# EAGLE design ds32 (EAGLE 6.6.0)

## Sheet 1 of 3
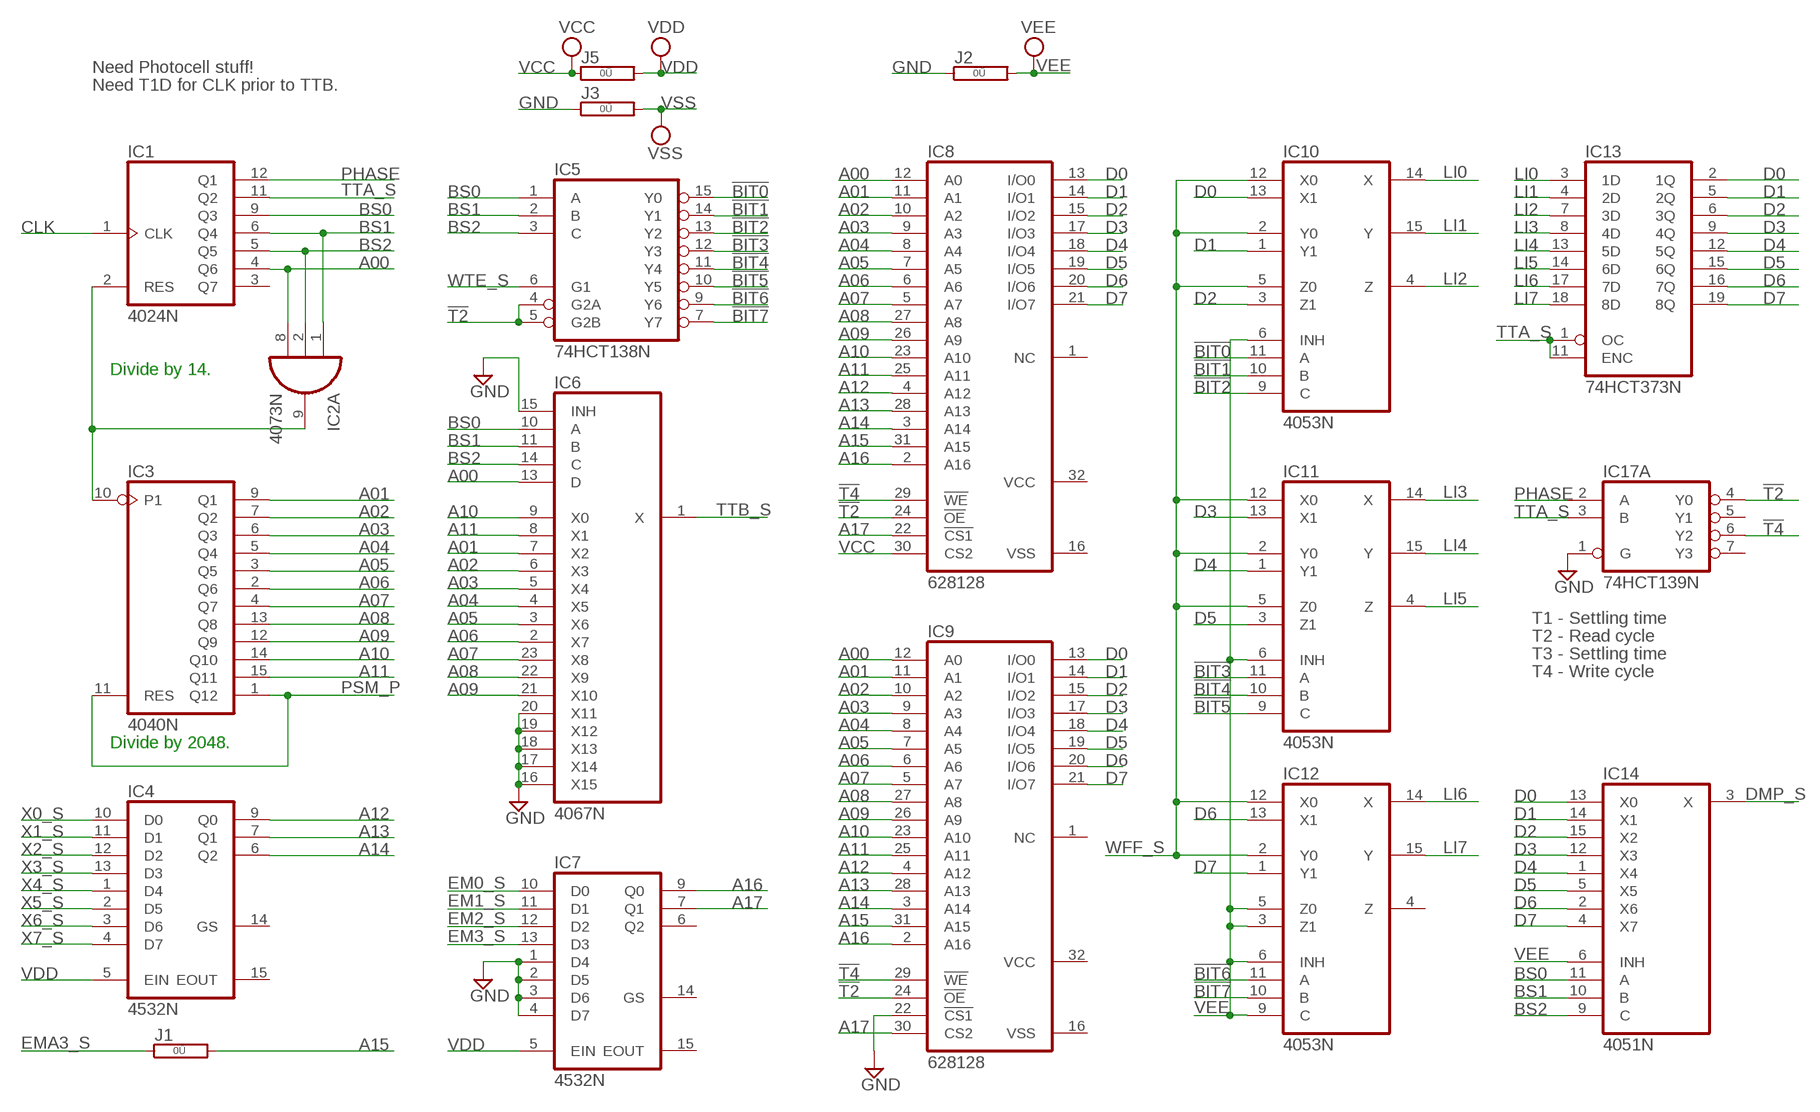
[diagram p0: schematic, sheet 1]

### Parts
IC1  4024N  [DIL14]
IC2  4073N  [DIL14]
IC3  4040N  [DIL16]
IC4  4532N  [DIL16]
IC5  74HCT138N  74LS138N  [DIL16]
IC6  4067N  [DIL24-6]
IC7  4532N  [DIL16]
IC8  628128  628128P  [DIL32]
IC9  628128  628128P  [DIL32]
IC10  4053N  [DIL16]
IC11  4053N  [DIL16]
IC12  4053N  [DIL16]
IC13  74HCT373N  74LS373N  [DIL20]
IC14  4051N  [DIL16]
IC17  74HCT139N  74LS139N  [DIL16]
J1  0R  [0R/10]
J2  0R  [0R/10]
J3  0R  [0R/10]
J5  0R  [0R/10]

### Nets
!BIT0: IC5.15(Y0) IC10.11(A)
!BIT1: IC5.14(Y1) IC10.10(B)
!BIT2: IC5.13(Y2) IC10.9(C)
!BIT3: IC5.12(Y3) IC11.11(A)
!BIT4: IC5.11(Y4) IC11.10(B)
!BIT5: IC5.10(Y5) IC11.9(C)
!BIT6: IC5.9(Y6) IC12.11(A)
!BIT7: IC5.7(Y7) IC12.10(B)
!T2: IC5.4(G2A) IC5.5(G2B) IC8.24(!OE) IC9.24(!OE) IC17.4(A:Y0)
!T4: IC8.29(!WE) IC9.29(!WE) IC17.6(A:Y2)
A00: IC1.4(Q6) IC2.8(A:I2) IC6.13(D) IC8.12(A0) IC9.12(A0)
A01: IC3.9(Q1) IC6.7(X2) IC8.11(A1) IC9.11(A1)
A02: IC3.7(Q2) IC6.6(X3) IC8.10(A2) IC9.10(A2)
A03: IC3.6(Q3) IC6.5(X4) IC8.9(A3) IC9.9(A3)
A04: IC3.5(Q4) IC6.4(X5) IC8.8(A4) IC9.8(A4)
A05: IC3.3(Q5) IC6.3(X6) IC8.7(A5) IC9.7(A5)
A06: IC3.2(Q6) IC6.2(X7) IC8.6(A6) IC9.6(A6)
A07: IC3.4(Q7) IC6.23(X8) IC8.5(A7) IC9.5(A7)
A08: IC3.13(Q8) IC6.22(X9) IC8.27(A8) IC9.27(A8)
A09: IC3.12(Q9) IC6.21(X10) IC8.26(A9) IC9.26(A9)
A10: IC3.14(Q10) IC6.9(X0) IC8.23(A10) IC9.23(A10)
A11: IC3.15(Q11) IC6.8(X1) IC8.25(A11) IC9.25(A11)
A12: IC4.9(Q0) IC8.4(A12) IC9.4(A12)
A13: IC4.7(Q1) IC8.28(A13) IC9.28(A13)
A14: IC4.6(Q2) IC8.3(A14) IC9.3(A14)
A15: IC8.31(A15) IC9.31(A15) J1.2
A16: IC7.9(Q0) IC8.2(A16) IC9.2(A16)
A17: IC7.7(Q1) IC8.22(!CS1) IC9.30(CS2)
BS0: IC1.9(Q3) IC5.1(A) IC6.10(A) IC14.11(A)
BS1: IC1.6(Q4) IC2.1(A:I0) IC5.2(B) IC6.11(B) IC14.10(B)
BS2: IC1.5(Q5) IC2.2(A:I1) IC5.3(C) IC6.14(C) IC14.9(C)
CLK: IC1.1(CLK) ; also sheet 3
D0: IC8.13(I/O0) IC9.13(I/O0) IC10.13(X1) IC13.2(1Q) IC14.13(X0)
D1: IC8.14(I/O1) IC9.14(I/O1) IC10.1(Y1) IC13.5(2Q) IC14.14(X1)
D2: IC8.15(I/O2) IC9.15(I/O2) IC10.3(Z1) IC13.6(3Q) IC14.15(X2)
D3: IC8.17(I/O3) IC9.17(I/O3) IC11.13(X1) IC13.9(4Q) IC14.12(X3)
D4: IC8.18(I/O4) IC9.18(I/O4) IC11.1(Y1) IC13.12(5Q) IC14.1(X4)
D5: IC8.19(I/O5) IC9.19(I/O5) IC11.3(Z1) IC13.15(6Q) IC14.5(X5)
D6: IC8.20(I/O6) IC9.20(I/O6) IC12.13(X1) IC13.16(7Q) IC14.2(X6)
D7: IC8.21(I/O7) IC9.21(I/O7) IC12.1(Y1) IC13.19(8Q) IC14.4(X7)
DMP_S: IC14.3(X) ; also sheet 2
EM0_S: IC7.10(D0) ; also sheet 2
EM1_S: IC7.11(D1) ; also sheet 2
EM2_S: IC7.12(D2) ; also sheet 2
EM3_S: IC7.13(D3) ; also sheet 2
EMA3_S: J1.1 ; also sheet 2
GND [Supply]: IC6.15(INH) IC6.16(X15) IC6.17(X14) IC6.18(X13) IC6.19(X12) IC6.20(X11) IC7.1(D4) IC7.2(D5) IC7.3(D6) IC7.4(D7) IC9.22(!CS1) IC17.1(A:G) J2.1 J3.1 ; also sheet 2,3
LI0: IC10.14(X) IC13.3(1D)
LI1: IC10.15(Y) IC13.4(2D)
LI2: IC10.4(Z) IC13.7(3D)
LI3: IC11.14(X) IC13.8(4D)
LI4: IC11.15(Y) IC13.13(5D)
LI5: IC11.4(Z) IC13.14(6D)
LI6: IC12.14(X) IC13.17(7D)
LI7: IC12.15(Y) IC13.18(8D)
N$1: IC1.2(RES) IC2.9(A:O) IC3.10(P1)
PHASE: IC1.12(Q1) IC17.2(A:A)
PSM_P: IC3.1(Q12) IC3.11(RES) ; also sheet 3
TTA_S: IC1.11(Q2) IC13.1(OC) IC13.11(ENC) IC17.3(A:B) ; also sheet 2
TTB_S: IC6.1(X) ; also sheet 2
VCC [Supply]: IC8.30(CS2) J5.1 ; also sheet 2,3
VDD [Supply]: IC4.5(EIN) IC7.5(EIN) J5.2
VEE: IC10.6(INH) IC11.6(INH) IC12.3(Z1) IC12.5(Z0) IC12.6(INH) IC12.9(C) IC14.6(INH) J2.2
VSS [Supply]: J3.2
WFF_S: IC10.2(Y0) IC10.5(Z0) IC10.12(X0) IC11.2(Y0) IC11.5(Z0) IC11.12(X0) IC12.2(Y0) IC12.12(X0) ; also sheet 2
WTE_S: IC5.6(G1) ; also sheet 2
X0_S: IC4.10(D0) ; also sheet 2
X1_S: IC4.11(D1) ; also sheet 2
X2_S: IC4.12(D2) ; also sheet 2
X3_S: IC4.13(D3) ; also sheet 2
X4_S: IC4.1(D4) ; also sheet 2
X5_S: IC4.2(D5) ; also sheet 2
X6_S: IC4.3(D6) ; also sheet 2
X7_S: IC4.4(D7) ; also sheet 2
Unconnected: IC1.3(Q7) IC2.10(C:O) IC2.11(C:I0) IC2.12(C:I1) IC2.13(C:I2) IC4.14(GS) IC4.15(EOUT) IC7.6(Q2) IC7.14(GS) IC7.15(EOUT) IC8.1(NC) IC9.1(NC) IC12.4(Z) IC17.5(A:Y1) IC17.7(A:Y3) IC17.9(B:Y3) IC17.10(B:Y2) IC17.11(B:Y1) IC17.12(B:Y0) IC17.13(B:B) IC17.14(B:A) IC17.15(B:G)

### Notes on the sheet
- Need Photocell stuff!
- Need T1D for CLK prior to TTB.
- Divide by 14.
- T1 - Settling time
- T2 - Read cycle
- T3 - Settling time
- T4 - Write cycle
- Divide by 2048.

## Sheet 2 of 3
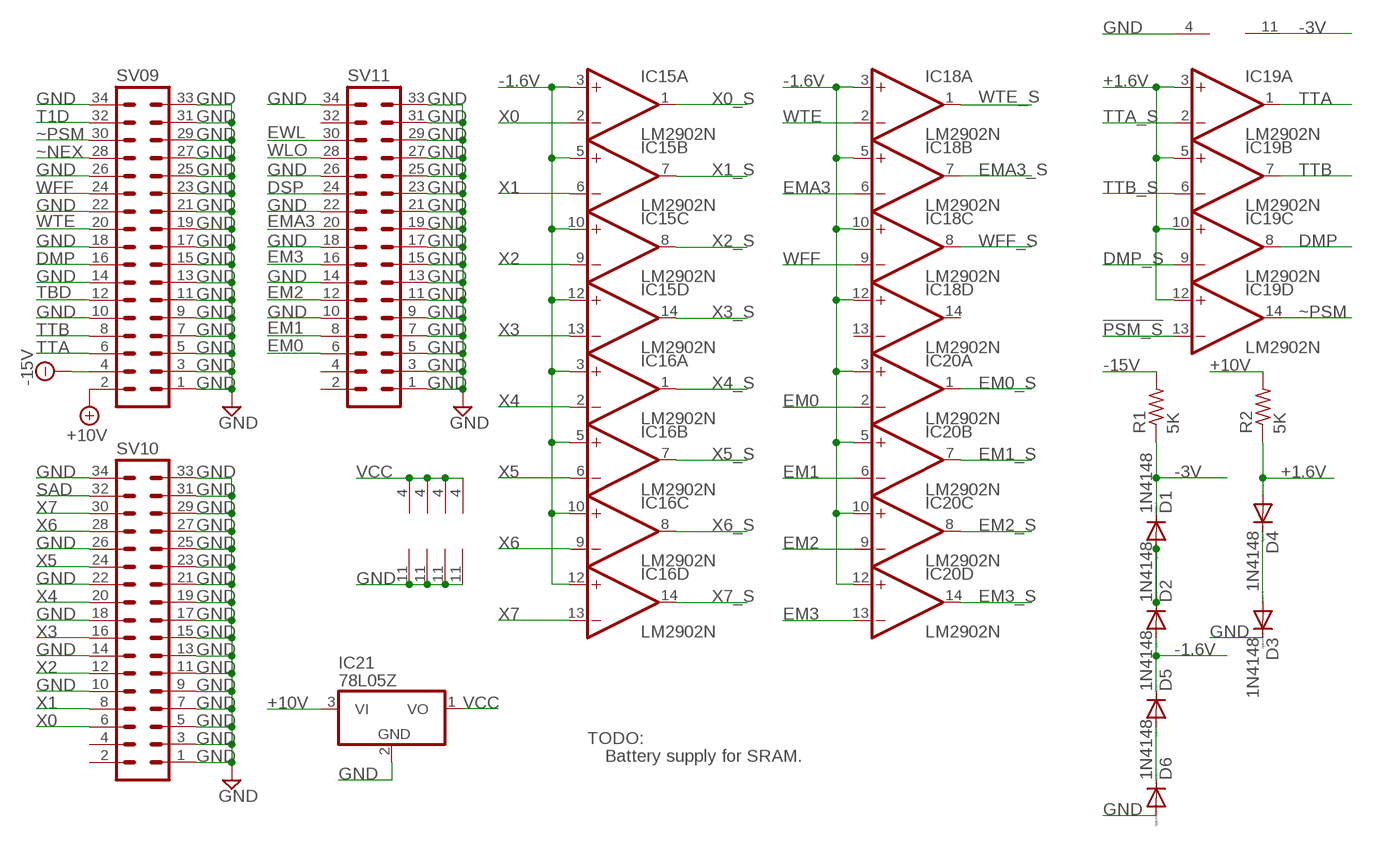
[diagram p1: schematic, sheet 2]

### Parts
D1  1N4148  1N4148DO35-10  [DO35-10]
D2  1N4148  1N4148DO35-10  [DO35-10]
D3  1N4148  1N4148DO35-10  [DO35-10]
D4  1N4148  1N4148DO35-10  [DO35-10]
D5  1N4148  1N4148DO35-10  [DO35-10]
D6  1N4148  1N4148DO35-10  [DO35-10]
IC15  LM2902N  [DIL14]
IC16  LM2902N  [DIL14]
IC18  LM2902N  [DIL14]
IC19  LM2902N  [DIL14]
IC20  LM2902N  [DIL14]
IC21  78L05Z  [TO92]
R1  5K  R-US_0207/10  [0207/10]
R2  5K  R-US_0207/10  [0207/10]
SV09  MA17-2  [MA17-2]
SV10  MA17-2  [MA17-2]
SV11  MA17-2  [MA17-2]

### Nets
!PSM_S: IC19.13(D:-IN) ; also sheet 3
+1.6V [Supply]: D4.A IC19.3(A:+IN) IC19.5(B:+IN) IC19.10(C:+IN) IC19.12(D:+IN) R2.1
+10V: IC21.3(VI) R2.2 SV09.2
-1.6V [Supply]: D2.A D5.C IC15.3(A:+IN) IC15.5(B:+IN) IC15.10(C:+IN) IC15.12(D:+IN) IC16.3(A:+IN) IC16.5(B:+IN) IC16.10(C:+IN) IC16.12(D:+IN) IC18.3(A:+IN) IC18.5(B:+IN) IC18.10(C:+IN) IC18.12(D:+IN) IC20.3(A:+IN) IC20.5(B:+IN) IC20.10(C:+IN) IC20.12(D:+IN)
-3V [Supply]: D1.C IC19.11(P:V-) R1.1 ; also sheet 3
-15V: R1.2 SV09.4
DMP: IC19.8(C:OUT) SV09.16
DMP_S: IC19.9(C:-IN) ; also sheet 1
DSP: SV11.24
EM0: IC20.2(A:-IN) SV11.6
EM0_S: IC20.1(A:OUT) ; also sheet 1
EM1: IC20.6(B:-IN) SV11.8
EM1_S: IC20.7(B:OUT) ; also sheet 1
EM2: IC20.9(C:-IN) SV11.12
EM2_S: IC20.8(C:OUT) ; also sheet 1
EM3: IC20.13(D:-IN) SV11.16
EM3_S: IC20.14(D:OUT) ; also sheet 1
EMA3: IC18.6(B:-IN) SV11.20
EMA3_S: IC18.7(B:OUT) ; also sheet 1
EWL: SV11.30
GND [Supply]: D3.C D6.A IC15.11(P:V-) IC16.11(P:V-) IC18.11(P:V-) IC19.4(P:V+) IC20.11(P:V-) IC21.2(GND) SV09.1 SV09.3 SV09.5 SV09.7 SV09.9 SV09.10 SV09.11 SV09.13 SV09.14 SV09.15 SV09.17 SV09.18 SV09.19 SV09.21 SV09.22 SV09.23 SV09.25 SV09.26 SV09.27 SV09.29 SV09.31 SV09.33 SV09.34 SV10.1 SV10.3 SV10.5 SV10.7 SV10.9 SV10.10 SV10.11 SV10.13 SV10.14 SV10.15 SV10.17 SV10.18 SV10.19 SV10.21 SV10.22 SV10.23 SV10.25 SV10.26 SV10.27 SV10.29 SV10.31 SV10.33 SV10.34 SV11.1 SV11.3 SV11.5 SV11.7 SV11.9 SV11.10 SV11.11 SV11.13 SV11.14 SV11.15 SV11.17 SV11.18 SV11.19 SV11.21 SV11.22 SV11.23 SV11.25 SV11.26 SV11.27 SV11.29 SV11.31 SV11.33 SV11.34 ; also sheet 1,3
N$2: D1.A D2.C
N$3: D3.A D4.C
N$5: D5.A D6.C
SAD: SV10.32
T1D: SV09.32
TBD: SV09.12
TTA: IC19.1(A:OUT) SV09.6
TTA_S: IC19.2(A:-IN) ; also sheet 1
TTB: IC19.7(B:OUT) SV09.8
TTB_S: IC19.6(B:-IN) ; also sheet 1
VCC [Supply]: IC15.4(P:V+) IC16.4(P:V+) IC18.4(P:V+) IC20.4(P:V+) IC21.1(VO) ; also sheet 1,3
WFF: IC18.9(C:-IN) SV09.24
WFF_S: IC18.8(C:OUT) ; also sheet 1
WLO: SV11.28 ; also sheet 3
WTE: IC18.2(A:-IN) SV09.20
WTE_S: IC18.1(A:OUT) ; also sheet 1
X0: IC15.2(A:-IN) SV10.6
X0_S: IC15.1(A:OUT) ; also sheet 1
X1: IC15.6(B:-IN) SV10.8
X1_S: IC15.7(B:OUT) ; also sheet 1
X2: IC15.9(C:-IN) SV10.12
X2_S: IC15.8(C:OUT) ; also sheet 1
X3: IC15.13(D:-IN) SV10.16
X3_S: IC15.14(D:OUT) ; also sheet 1
X4: IC16.2(A:-IN) SV10.20
X4_S: IC16.1(A:OUT) ; also sheet 1
X5: IC16.6(B:-IN) SV10.24
X5_S: IC16.7(B:OUT) ; also sheet 1
X6: IC16.9(C:-IN) SV10.28
X6_S: IC16.8(C:OUT) ; also sheet 1
X7: IC16.13(D:-IN) SV10.30
X7_S: IC16.14(D:OUT) ; also sheet 1
~NEX: SV09.28 ; also sheet 3
~PSM: IC19.14(D:OUT) SV09.30
Unconnected: IC18.13(D:-IN) IC18.14(D:OUT) SV10.2 SV10.4 SV11.2 SV11.4 SV11.32

### Notes on the sheet
- TODO:
- Battery supply for SRAM.

## Sheet 3 of 3
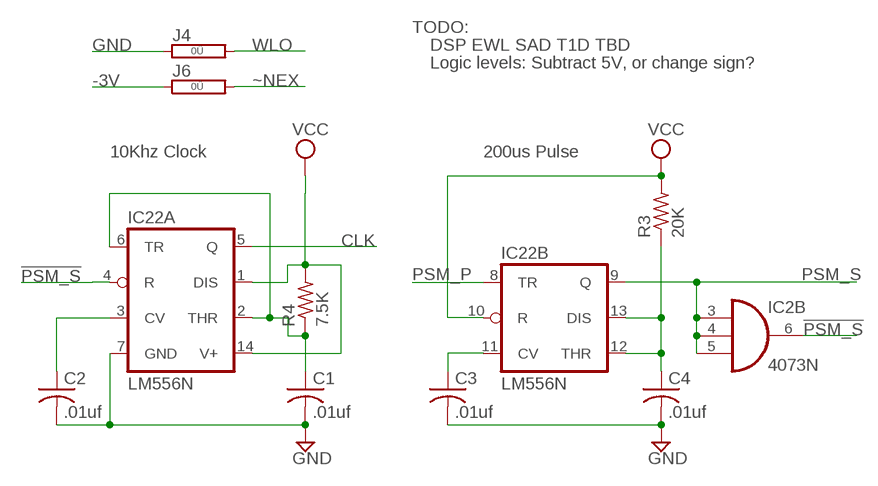
[diagram p2: schematic, sheet 3]

### Parts
C1  .01uf  C-US050-025X075  [C050-025X075]
C2  .01uf  C-US050-025X075  [C050-025X075]
C3  .01uf  C-US050-025X075  [C050-025X075]
C4  .01uf  C-US050-025X075  [C050-025X075]
IC22  LM556N  [DIL14]
J4  0R  [0R/10]
J6  0R  [0R/10]
R3  20K  R-US_0207/10  [0207/10]
R4  7.5K  R-US_0207/10  [0207/10]

### Nets
!PSM_S: IC2.6(B:O) IC22.4(A:R) ; also sheet 2
-3V [Supply]: J6.1 ; also sheet 2
CLK: IC22.5(A:Q) ; also sheet 1
GND [Supply]: C1.2 C2.2 C3.2 C4.2 IC22.7(A:GND) J4.1 ; also sheet 1,2
N$6: C1.1 IC22.2(A:THR) IC22.6(A:TR) R4.1
N$7: C2.1 IC22.3(A:CV)
N$8: C4.1 IC22.12(B:THR) IC22.13(B:DIS) R3.1
N$10: C3.1 IC22.11(B:CV)
PSM_P: IC22.8(B:TR) ; also sheet 1
PSM_S: IC2.3(B:I0) IC2.4(B:I1) IC2.5(B:I2) IC22.9(B:Q)
VCC [Supply]: IC22.1(A:DIS) IC22.10(B:R) IC22.14(A:V+) R3.2 R4.2 ; also sheet 1,2
WLO: J4.2 ; also sheet 2
~NEX: J6.2 ; also sheet 2

### Notes on the sheet
- TODO:
- DSP EWL SAD T1D TBD
- Logic levels: Subtract 5V, or change sign?
- 10Khz Clock | 200us Pulse

## Power pins joined to a net without a drawn wire
GND: IC5.8(GND) IC10.8(GND) IC11.8(GND) IC12.8(GND) IC13.10(GND) IC14.8(GND) IC17.8(P:GND)
VCC: IC5.16(VCC) IC8.32(VCC) IC9.32(VCC) IC10.16(VCC) IC11.16(VCC) IC12.16(VCC) IC13.20(VCC) IC14.16(VCC) IC17.16(P:VCC)
VDD: IC1.14(VDD) IC2.14(P:VDD) IC3.16(VDD) IC4.16(VDD) IC6.24(VDD) IC7.16(VDD)
VEE: IC10.7(VEE) IC11.7(VEE) IC12.7(VEE) IC14.7(VEE)
VSS: IC1.7(VSS) IC2.7(P:VSS) IC3.8(VSS) IC4.8(VSS) IC6.12(VSS) IC7.8(VSS) IC8.16(VSS) IC9.16(VSS)

## Library data of the parts
C1-C4 = rcl:C-US: CAPACITOR, American symbol
D1-D6 = diode:1N4148: DIODE high speed (Philips)
IC1 = 40xx:4024: 7-stage binary/ripple COUNTER
IC2 = 40xx:4073: Triple 3-input AND
IC3 = 40xx:4040: 12-stage binary/ripple COUNTER
IC4 IC7 = 45xx:4532: 8-bit PRIORITY ENCODER
IC5 = 74xx-us:74*138: 3-line to 8-line DECODER/DEMULTIPLEXER
IC6 = 40xx:4067: 16-channel ANALOG MULTIPLEXER
IC8 IC9 = memory-hitachi:628128P: MEMORY; OC_FARNELL: unknown; OC_NEWARK: unknown
IC10-IC12 = 40xx:4053: Triple 2-channel ANALOG MULTIPLEXER
IC13 = 74xx-us:74*373: Octal D type transparent LATCH, edge triggered
IC14 = 40xx:4051: 8-channel ANALOG MULTIPLEXER
IC15 IC16 IC18-IC20 = linear:LM2902: Low power quad operational amplifier Source: Data sgeet <http://www.st.com/internet/com/TECHNICAL_RESOURCES/TECHNICAL_LITERATURE/DATASHEET/CD00000533.pdf>
IC17 = 74xx-us:74*139: Dual 2-line to 4-line DECODER/DEMULTIPLEXER
IC21 = linear:78*: Positive VOLTAGE REGULATOR Source: http://cache.national.com/ds/LM/LM78L05.pdf http://www.fairchildsemi.com/ds/LM/LM7805.pdf
IC22 = linear:*556: Dual TIMER
J1-J6 = jumper:0R: Bridge 0R 10mm
R1-R4 = rcl:R-US_: RESISTOR, American symbol
SV09 SV10 SV11 = con-lstb:MA17-2: PIN HEADER; OC_FARNELL: unknown; OC_NEWARK: unknown

## Net classes
1 Supply: width 0.381 mm

## Board
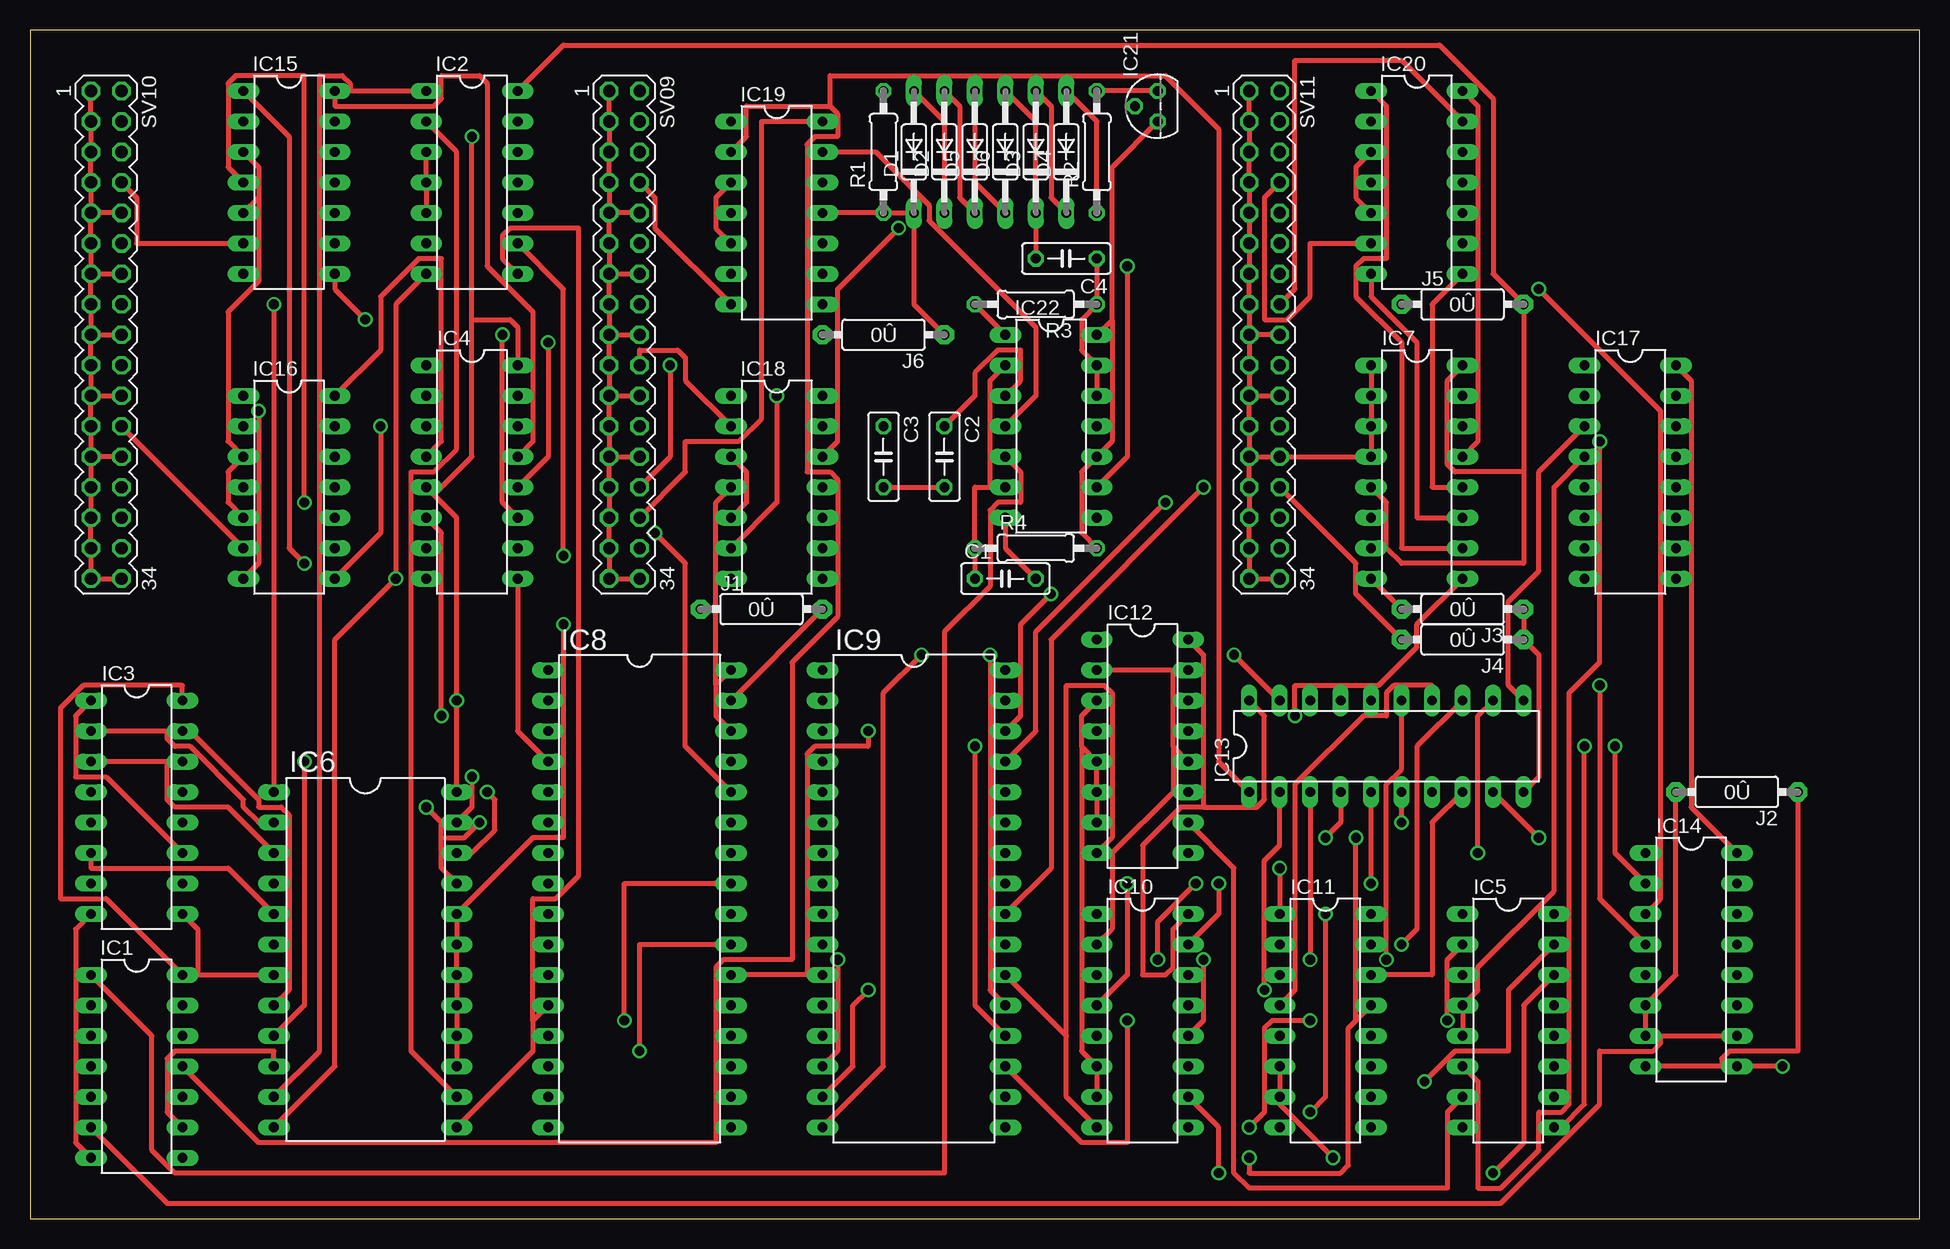
[diagram p3: board, top side]
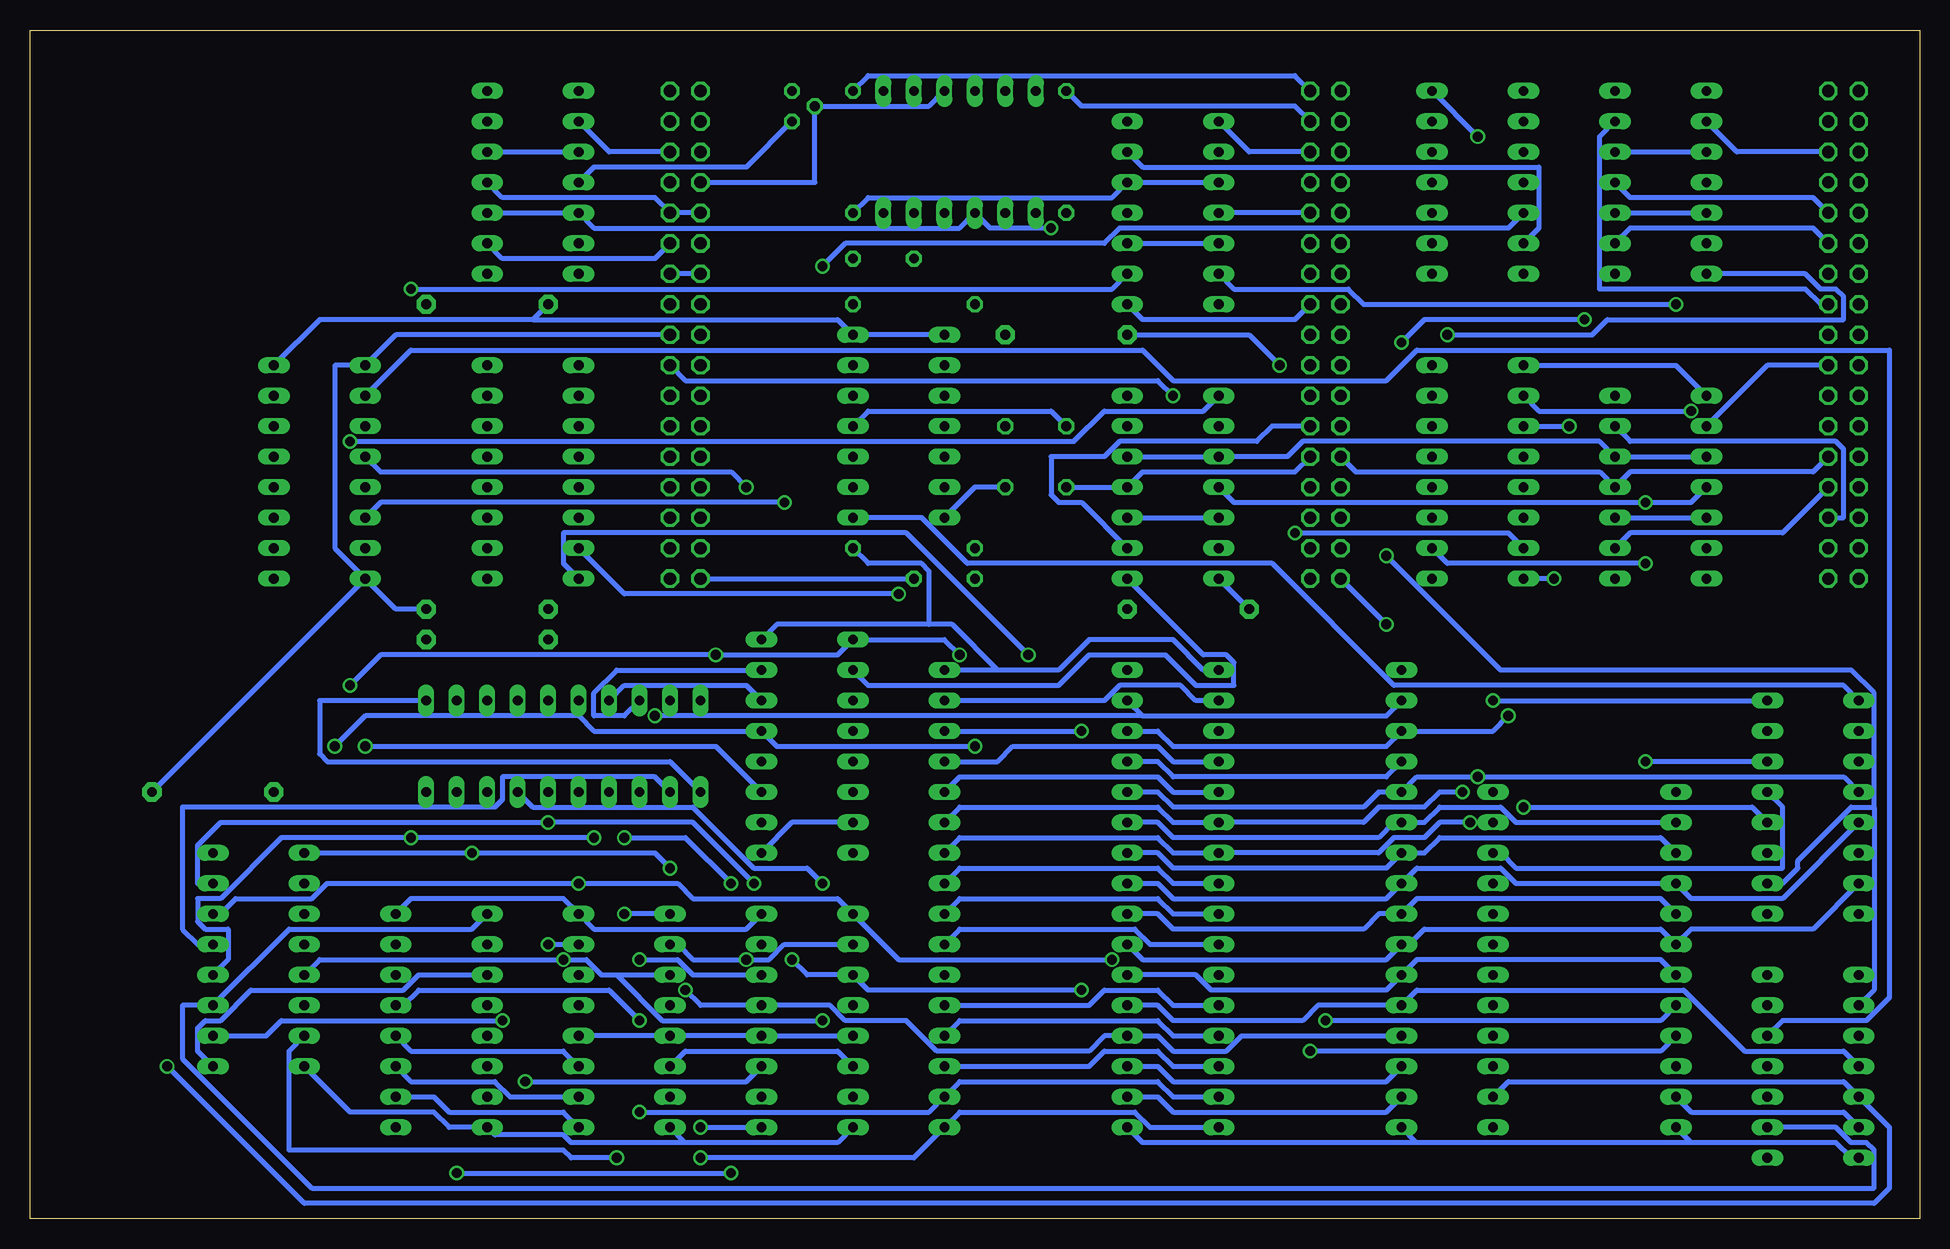
[diagram p4: board, bottom side, seen from below]

Size 157.48 x 99.06 mm. Coordinates in mm from the lower left corner, seen from the top.
Outline: 0,0 157.48,0 157.48,99.06 0,99.06 0,0
Copper layers (1+16): Top 0.035mm / dielectric 1.5mm / Bottom 0.035mm
Design rules "16mils": minimum track width 16mil, minimum drill 32mil, track to track 15mil, track to pad 10mil, pad to pad 10mil, via to via 10mil, smd to smd 10mil, copper to edge 13mil, drill to drill 10mil, minimum pad ring 10mil, minimum via ring 8mil, stop-mask expansion 0mil, vias tented up to drill 0mil, thermal gap 10mil

### Footprints (pad centres in the part's own frame; a part is rotated, then mirrored left to right if it is on the bottom)
C050-025X075 = drill 0.813 octagon: 1 -2.54,0; 2 2.54,0
DO35-10 = drill 0.813 long: A 5.08,0; C -5.08,0
DIL14 = drill 0.813 long: 1 -7.62,-3.81; 2 -5.08,-3.81; 3 -2.54,-3.81; 4 0,-3.81; 5 2.54,-3.81; 6 5.08,-3.81; 7 7.62,-3.81; 8 7.62,3.81; 9 5.08,3.81; 10 2.54,3.81; 11 0,3.81; 12 -2.54,3.81; 13 -5.08,3.81; 14 -7.62,3.81
DIL16 = drill 0.813 long: 1 -8.89,-3.81; 2 -6.35,-3.81; 3 -3.81,-3.81; 4 -1.27,-3.81; 5 1.27,-3.81; 6 3.81,-3.81; 7 6.35,-3.81; 8 8.89,-3.81; 9 8.89,3.81; 10 6.35,3.81; 11 3.81,3.81; 12 1.27,3.81; 13 -1.27,3.81; 14 -3.81,3.81; 15 -6.35,3.81; 16 -8.89,3.81
DIL24-6 = drill 0.813 long: 1 -13.97,-7.62; 2 -11.43,-7.62; 3 -8.89,-7.62; 4 -6.35,-7.62; 5 -3.81,-7.62; 6 -1.27,-7.62; 7 1.27,-7.62; 8 3.81,-7.62; 9 6.35,-7.62; 10 8.89,-7.62; 11 11.43,-7.62; 12 13.97,-7.62; 13 13.97,7.62; 14 11.43,7.62; 15 8.89,7.62; 16 6.35,7.62; 17 3.81,7.62; 18 1.27,7.62; 19 -1.27,7.62; 20 -3.81,7.62; 21 -6.35,7.62; 22 -8.89,7.62; 23 -11.43,7.62; 24 -13.97,7.62
DIL32 = drill 0.813 long: 1 -19.05,-7.62; 2 -16.51,-7.62; 3 -13.97,-7.62; 4 -11.43,-7.62; 5 -8.89,-7.62; 6 -6.35,-7.62; 7 -3.81,-7.62; 8 -1.27,-7.62; 9 1.27,-7.62; 10 3.81,-7.62; 11 6.35,-7.62; 12 8.89,-7.62; 13 11.43,-7.62; 14 13.97,-7.62; 15 16.51,-7.62; 16 19.05,-7.62; 17 19.05,7.62; 18 16.51,7.62; 19 13.97,7.62; 20 11.43,7.62; 21 8.89,7.62; 22 6.35,7.62; 23 3.81,7.62; 24 1.27,7.62; 25 -1.27,7.62; 26 -3.81,7.62; 27 -6.35,7.62; 28 -8.89,7.62; 29 -11.43,7.62; 30 -13.97,7.62; 31 -16.51,7.62; 32 -19.05,7.62
DIL20 = drill 0.813 long: 1 -11.43,-3.81; 2 -8.89,-3.81; 3 -6.35,-3.81; 4 -3.81,-3.81; 5 -1.27,-3.81; 6 1.27,-3.81; 7 3.81,-3.81; 8 6.35,-3.81; 9 8.89,-3.81; 10 11.43,-3.81; 11 11.43,3.81; 12 8.89,3.81; 13 6.35,3.81; 14 3.81,3.81; 15 1.27,3.81; 16 -1.27,3.81; 17 -3.81,3.81; 18 -6.35,3.81; 19 -8.89,3.81; 20 -11.43,3.81
TO92 = drill 0.813 octagon: 1 -1.27,0; 2 0,1.905; 3 1.27,0
0R/10 = drill 0.813 pad 1.6 octagon: 1 -5.08,0; 2 5.08,0
0207/10 = drill 0.813 octagon: 1 -5.08,0; 2 5.08,0
MA17-2 = drill 1.016 octagon: 1 -20.32,-1.27; 2 -20.32,1.27; 3 -17.78,-1.27; 4 -17.78,1.27; 5 -15.24,-1.27; 6 -15.24,1.27; 7 -12.7,-1.27; 8 -12.7,1.27; 9 -10.16,-1.27; 10 -10.16,1.27; 11 -7.62,-1.27; 12 -7.62,1.27; 13 -5.08,-1.27; 14 -5.08,1.27; 15 -2.54,-1.27; 16 -2.54,1.27; 17 0,-1.27; 18 0,1.27; 19 2.54,-1.27; 20 2.54,1.27; 21 5.08,-1.27; 22 5.08,1.27; 23 7.62,-1.27; 24 7.62,1.27; 25 10.16,-1.27; 26 10.16,1.27; 27 12.7,-1.27; 28 12.7,1.27; 29 15.24,-1.27; 30 15.24,1.27; 31 17.78,-1.27; 32 17.78,1.27; 33 20.32,-1.27; 34 20.32,1.27

### Placement (x,y rotation side)
C1  81.28,53.34 0 top
C2  76.2,63.5 270 top
C3  71.12,63.5 270 top
C4  86.36,80.01 180 top
D1  73.66,88.9 90 top
D2  76.2,88.9 90 top
D3  83.82,88.9 90 top
D4  86.36,88.9 90 top
D5  78.74,88.9 90 top
D6  81.28,88.9 90 top
IC1  8.89,12.7 270 top
IC2  36.83,86.36 270 top
IC3  8.89,34.29 270 top
IC4  36.83,62.23 270 top
IC5  123.19,16.51 270 top
IC6  27.94,21.59 270 top
IC7  115.57,62.23 270 top
IC8  50.8,26.67 270 top
IC9  73.66,26.67 270 top
IC10  92.71,16.51 270 top
IC11  107.95,16.51 270 top
IC12  92.71,39.37 270 top
IC13  113.03,39.37 0 top
IC14  138.43,21.59 270 top
IC15  21.59,86.36 270 top
IC16  21.59,60.96 270 top
IC17  133.35,62.23 270 top
IC18  62.23,60.96 270 top
IC19  62.23,83.82 270 top
IC20  115.57,86.36 270 top
IC21  93.98,92.71 90 top
IC22  85.09,66.04 270 top
J1  60.96,50.8 0 top
J2  142.24,35.56 180 top
J3  119.38,50.8 180 top
J4  119.38,48.26 180 top
J5  119.38,76.2 0 top
J6  71.12,73.66 180 top
R1  71.12,88.9 90 top
R2  88.9,88.9 90 top
R3  83.82,76.2 180 top
R4  83.82,55.88 0 top
SV09  49.53,73.66 270 top
SV10  6.35,73.66 270 top
SV11  102.87,73.66 270 top

### Tracks (layer width: path | path; a pad name or v marks a point on that pad's centre or on a via)
!BIT0  (via drill 0.81)
  Top 0.406: v116.2,11.43 118.75,13.97 123.19,13.97 123.19,19.05 IC5.15
  Bottom 0.406: IC10.11 97.79,11.43 v116.2,11.43
!BIT1  (via drill 0.81)
  Top 0.406: IC10.10 99.06,7.62 v99.06,3.81 | v121.92,3.81 124.46,6.35 124.46,17.78 IC5.14
  Bottom 0.406: v121.92,3.81 v99.06,3.81
!BIT2  (via drill 0.81)
  Top 0.406: v101.6,7.62 102.87,8.89 102.87,15.88 103.5,16.51 v106.68,16.51
  Bottom 0.406: v101.6,7.62 IC10.9 | v106.68,16.51 109.22,19.05 125.09,19.05 126.36,17.78 IC5.13
!BIT3
  Bottom 0.406: IC11.11 113.03,13.97 125.73,13.97 IC5.12
!BIT4
  Bottom 0.406: IC11.10 117.47,10.16 118.75,11.43 125.73,11.43 IC5.11
!BIT5
  Bottom 0.406: IC11.9 113.03,8.89 122.56,8.89 123.83,10.16 IC5.10
!BIT6  (via drill 0.81)
  Top 0.406: v129.54,39.37 129.54,9.53 127.64,7.62 IC5.9
  Bottom 0.406: IC12.11 100.33,39.37 v129.54,39.37
!BIT7
  Top 0.406: IC12.10 100.33,29.21 100.33,3.81 101.6,2.54 118.11,2.54 118.11,8.89 IC5.7
!PSM_S
  Top 0.406: IC22.4 83.82,68.58 83.82,74.3 74.93,83.19 74.93,84.45 70.48,88.9 IC19.13
  Bottom 0.406: IC2.6 31.75,82.55 31.75,87.63 64.77,87.63 IC19.13
!T2  (via drill 0.81)
  Top 0.406: IC5.5 IC5.4 120.65,19.05 120.65,20.95 127,27.3 127,60.96 IC17.4 | IC9.24 85.09,29.21 85.09,48.26 v97.79,60.96
  Bottom 0.406: IC8.24 62.23,25.4 63.5,26.67 80.01,26.67 IC9.24 | v97.79,60.96 99.06,62.23 128.27,62.23 IC17.4
!T4  (via drill 0.81)
  Top 0.406: v94.61,59.69 83.82,48.9 83.82,40.64 IC9.29
  Bottom 0.406: IC8.29 62.23,38.1 63.5,39.37 75.56,39.37 76.83,38.1 IC9.29 | IC17.6 128.27,59.69 v94.61,59.69
+1.6V
  Top 0.406: IC19.5 57.15,82.55 57.15,85.09 IC19.3 | D4.A 88.9,91.44 R2.1
  Bottom 0.406: IC19.10 IC19.5 | IC19.3 IC19.12 67.31,85.09 87.63,85.09 R2.1
+10V
  Top 0.406: IC21.3 R2.2
  Bottom 0.406: SV09.2 52.07,95.25 87.63,95.25 R2.2
-1.6V  (via drill 0.81)
  Top 0.406: D5.C 77.47,85.09 77.47,92.71 D2.A | IC20.5 110.49,85.09 110.49,87.63 IC20.3 | IC18.5 59.69,59.69 59.69,62.23 IC18.3 | IC16.5 16.51,59.69 16.51,62.23 IC16.3 16.51,64.77 16.51,75.56 19.05,78.11 19.05,85.09 | 19.05,85.09 IC15.5 | 19.05,85.09 19.05,87.63 IC15.3 | v72.39,82.55 67.31,77.47 67.31,64.77 IC18.12
  Bottom 0.406: IC20.10 IC20.5 110.49,82.55 80.01,82.55 D5.C 77.47,82.55 v72.39,82.55 | IC20.12 IC20.3 | IC18.10 IC18.5 | IC18.12 IC18.3 52.7,63.5 51.44,64.77 26.67,64.77 IC16.12 IC16.3 | IC16.10 IC16.5 | IC15.10 IC15.5 | IC15.12 IC15.3
-3V
  Top 0.406: IC19.11 R1.1 D1.C 73.66,76.2 J6.1
-15V
  Bottom 0.406: R1.2 69.85,92.71 52.07,92.71 SV09.4
A00
  Top 0.406: IC6.13 41.91,13.97 41.91,16.51 | IC8.12 41.91,16.51 | IC2.8 39.37,80.01 39.37,81.92 40.01,82.55 45.72,82.55 45.72,28.57 43.81,26.67 41.91,26.67 41.91,16.51
  Bottom 0.406: IC1.4 6.35,13.97 14.61,13.97 19.68,19.05 41.91,19.05 IC8.12 50.16,17.78 51.44,16.51 62.23,16.51 63.5,17.78 IC9.12
A01
  Top 0.406: IC6.7 13.97,20.32 13.97,24.13 IC3.9
  Bottom 0.406: IC6.7 21.59,21.59 41.91,21.59 IC8.11 44.45,19.05 59.05,19.05 60.33,20.32 IC9.11
A02
  Bottom 0.406: IC3.7 8.89,24.13 19.05,24.13 IC6.6 21.59,24.13 41.27,24.13 42.55,22.86 IC8.10 44.45,21.59 64.77,21.59 IC9.10
A03
  Top 0.406: IC6.5 16.51,29.21 5.08,29.21 IC3.6
  Bottom 0.406: IC6.5 21.59,26.67 41.91,26.67 IC8.9 45.09,25.4 46.35,24.13 62.23,24.13 63.5,25.4 IC9.9
A04
  Bottom 0.406: IC3.5 11.43,26.67 19.05,26.67 IC6.4 33.66,27.94 34.92,29.21 41.91,29.21 IC8.8 44.45,26.67 62.23,26.67 63.5,27.94 IC9.8
A05
  Top 0.406: IC3.3 11.43,38.1 11.43,34.92 12.06,34.29 16.51,34.29 IC6.3
  Bottom 0.406: IC6.3 21.59,31.75 40.01,31.75 41.27,30.48 IC8.7 44.45,29.21 62.23,29.21 63.5,30.48 IC9.7
A06
  Top 0.406: IC3.2 11.43,40.64 11.43,40.01 12.06,39.37 13.34,39.37 17.78,34.92 17.78,34.29 19.05,33.02 IC6.2
  Bottom 0.406: IC6.2 33.66,33.02 34.92,34.29 40.01,34.29 41.27,33.02 IC8.6 43.81,33.02 45.09,31.75 62.23,31.75 63.5,33.02 IC9.6
A07  (via drill 0.81)
  Top 0.406: IC6.23 36.83,34.29 v36.83,36.83
  Bottom 0.406: IC3.4 6.35,36.83 v36.83,36.83 41.91,36.83 IC8.5 45.09,35.56 46.35,34.29 62.23,34.29 63.5,35.56 IC9.5
A08  (via drill 0.81)
  Top 0.406: v38.1,35.56 38.73,34.92 38.73,32.38 36.83,30.48 IC6.22
  Bottom 0.406: IC9.27 80.01,34.29 63.5,34.29 62.23,33.02 IC8.27 46.35,33.02 45.09,34.29 41.27,34.29 40.01,35.56 v38.1,35.56 | IC3.13 11.43,34.29 11.43,29.21 33.66,29.21 34.92,30.48 IC6.22
A09  (via drill 0.81)
  Top 0.406: v33.02,34.29 34.29,33.02 34.29,31.75 | 34.29,31.75 34.29,29.21 IC6.21 | v37.47,33.02 36.2,31.75 34.29,31.75
  Bottom 0.406: IC9.26 80.01,31.75 63.5,31.75 62.23,30.48 IC8.26 45.09,30.48 43.81,31.75 41.27,31.75 40.01,33.02 v37.47,33.02 | IC3.12 13.97,34.29 v33.02,34.29
A10  (via drill 0.81)
  Top 0.406: IC6.9 22.86,17.78 v22.86,38.1 | IC8.23 50.8,22.86 v50.8,13.97
  Bottom 0.406: IC8.23 64.14,22.86 65.41,24.13 80.01,24.13 IC9.23 | IC3.14 v22.86,38.1 | v50.8,13.97 21.59,13.97 IC6.9
A11  (via drill 0.81)
  Top 0.406: IC6.8 21.59,19.05 21.59,33.66 20.95,34.29 19.05,34.29 19.05,34.92 13.34,40.64 IC3.15 | IC8.25 49.53,27.94 v49.53,16.51
  Bottom 0.406: IC8.25 62.23,27.94 63.5,29.21 80.01,29.21 IC9.25 | v49.53,16.51 21.59,16.51 IC6.8
A12
  Top 0.406: IC8.4 40.64,40.64 IC4.9
  Bottom 0.406: IC9.4 63.5,38.1 62.23,36.83 44.45,36.83 IC8.4
A13  (via drill 0.81)
  Top 0.406: v52.07,57.15 54.61,54.61 54.61,39.37 IC8.28
  Bottom 0.406: IC8.28 62.23,35.56 63.5,36.83 80.01,36.83 IC9.28 | IC4.7 34.29,57.15 v52.07,57.15
A14  (via drill 0.81)
  Top 0.406: IC4.6 34.29,57.15 v34.29,41.91
  Bottom 0.406: IC9.3 63.5,40.64 62.23,39.37 44.45,39.37 IC8.3 35.56,40.64 v34.29,41.91
A15
  Top 0.406: J1.2 IC8.31
  Bottom 0.406: IC9.31 67.94,43.18 66.67,44.45 61.59,44.45 60.33,43.18 IC8.31
A16  (via drill 0.81)
  Top 0.406: IC7.9 115.57,49.53 115.57,47.62 112.39,44.45 105.41,44.45 v105.41,41.91
  Bottom 0.406: IC8.2 44.45,41.91 64.77,41.91 | IC9.2 64.77,41.91 | 64.77,41.91 v105.41,41.91
A17  (via drill 0.81)
  Top 0.406: IC8.22 64.77,20.32 64.77,38.73 65.41,39.37 69.85,39.37 v69.85,40.64 | v85.09,52.07 82.55,49.53 82.55,41.91 IC9.30
  Bottom 0.406: IC9.30 v69.85,40.64 | IC7.7 107.95,52.07 v85.09,52.07
BS0
  Top 0.406: IC1.9 11.43,8.89 11.43,13.34 12.06,13.97 20.32,13.97 IC6.10
  Bottom 0.406: IC5.1 120.65,24.13 135.89,24.13 IC14.11 144.78,17.78 144.78,13.34 133.99,2.54 3.81,2.54 3.81,5.71 4.45,6.35 5.71,6.35 6.99,7.62 IC1.9
BS1  (via drill 0.81)
  Top 0.406: IC5.2 118.11,21.59 v118.11,16.51 | IC2.1 26.67,93.98 26.67,94.61 26.04,95.25 24.13,95.25 24.13,13.97 IC6.11 | IC14.10 135.89,15.24 135.89,14.61 135.25,13.97 130.81,13.97 130.81,9.53 122.56,1.27 11.43,1.27 6.35,6.35 IC1.6
  Bottom 0.406: v118.11,16.51 136.53,16.51 137.79,15.24 IC14.10 | IC1.6 6.35,8.89 19.05,8.89 IC6.11
BS2  (via drill 0.81)
  Top 0.406: IC2.2 35.56,88.9 35.56,64.14 33.66,62.23 31.75,62.23 31.75,13.97 IC6.14 | v146.05,12.7 IC14.9
  Bottom 0.406: IC5.3 125.09,20.32 126.36,19.05 139.06,19.05 141.6,16.51 142.88,16.51 143.51,15.88 143.51,13.97 142.88,13.34 IC14.9 | IC6.14 34.29,11.43 6.35,11.43 IC1.5 2.54,7.62 2.54,2.54 3.81,1.27 134.62,1.27 v146.05,12.7
CLK
  Top 0.406: IC1.1 10.16,15.24 10.16,5.71 12.06,3.81 76.2,3.81 76.2,48.9 80.01,52.7 80.01,59.05 80.64,59.69 82.55,59.69 82.55,62.23 IC22.5
D0  (via drill 0.81)
  Top 0.406: IC13.2 104.14,31.11 102.87,29.84 v102.87,19.05
  Bottom 0.406: IC14.13 143.51,22.86 144.78,24.13 144.78,34.29 118.75,34.29 118.11,34.92 118.11,36.83 105.41,36.83 IC13.2 | IC8.13 56.52,15.24 57.78,13.97 62.23,13.97 63.5,15.24 IC9.13 67.94,15.24 69.22,13.97 81.92,13.97 84.45,16.51 89.53,16.51 90.81,17.78 IC10.13 101.6,17.78 v102.87,19.05
D1  (via drill 0.81)
  Top 0.406: v111.76,27.94 IC13.5 | IC9.14 67.31,13.97 v67.31,21.59
  Bottom 0.406: IC8.14 44.45,11.43 62.23,11.43 63.5,12.7 IC9.14 | IC14.14 141.6,25.4 140.34,26.67 133.99,26.67 132.72,27.94 v111.76,27.94 103.5,27.94 102.23,26.67 90.17,26.67 IC10.1 85.09,21.59 v67.31,21.59
D2  (via drill 0.81)
  Top 0.406: v114.3,33.02 IC13.6 | v69.85,19.05 68.58,17.78 68.58,12.7 IC9.15 | v97.16,27.94 93.98,24.77 v93.98,21.59
  Bottom 0.406: IC14.15 143.51,27.94 143.51,31.11 141.6,33.02 v114.3,33.02 102.23,33.02 v97.16,27.94 | IC8.15 44.45,8.89 62.23,8.89 63.5,10.16 IC9.15 | v69.85,19.05 87.63,19.05 IC10.3 92.71,20.32 v93.98,21.59
D3  (via drill 0.81)
  Top 0.406: IC13.9 v125.73,31.75 | 110.49,16.51 109.86,15.88 109.86,4.45 109.22,3.81 101.6,3.81 v101.6,5.08 | 110.49,16.51 IC11.13 | 110.49,16.51 v110.49,31.75
  Bottom 0.406: IC14.12 140.97,21.59 140.97,24.13 142.88,24.13 143.51,24.77 143.51,26.67 141.6,26.67 136.53,31.75 v125.73,31.75 v110.49,31.75 | IC8.17 64.14,7.62 65.41,8.89 80.01,8.89 IC9.17 83.82,5.08 v101.6,5.08
D4  (via drill 0.81)
  Top 0.406: v104.14,29.21 IC11.1 | IC13.12 120.65,41.91 v120.65,30.48 | v106.68,8.89 107.95,10.16 v107.95,25.4
  Bottom 0.406: IC8.18 62.23,10.16 63.5,11.43 80.01,11.43 IC9.18 82.55,8.89 v106.68,8.89 | v104.14,29.21 105.41,30.48 v120.65,30.48 IC14.1 | IC11.1 v107.95,25.4
D5  (via drill 0.81)
  Top 0.406: IC13.15 114.3,37.47 113.03,36.2 v113.03,21.59 | IC9.19 87.63,6.35 91.44,6.35 v91.44,16.51
  Bottom 0.406: IC8.19 62.23,12.7 63.5,13.97 67.94,13.97 69.22,12.7 IC9.19 | 108.58,20.32 109.86,20.32 111.12,21.59 v113.03,21.59 133.35,21.59 IC14.5 | 108.58,20.32 IC11.3 | v91.44,16.51 104.78,16.51 108.58,20.32
D6  (via drill 0.81)
  Top 0.406: IC14.2 132.08,30.48 v132.08,39.37 | IC9.20 78.74,17.78 v78.74,39.37
  Bottom 0.406: IC8.20 62.23,15.24 63.5,16.51 80.01,16.51 IC9.20 | 111.76,41.91 110.49,40.64 IC12.13 95.25,39.37 v78.74,39.37 | IC13.16 111.76,41.91 | v132.08,39.37 129.54,41.91 111.76,41.91
D7  (via drill 0.81)
  Top 0.406: IC13.19 v100.33,46.99 | IC14.4 130.81,26.67 v130.81,44.45 | IC9.21 80.01,19.05 v80.01,46.99
  Bottom 0.406: IC8.21 62.23,17.78 63.5,19.05 67.94,19.05 69.22,17.78 IC9.21 | v130.81,44.45 128.27,46.99 v100.33,46.99 90.17,46.99 IC12.1 81.28,48.26 v80.01,46.99
DMP
  Bottom 0.406: IC19.8 64.77,74.93 52.07,74.93 SV09.16
DMP_S  (via drill 0.81)
  Top 0.406: v125.73,77.47 135.89,67.31 135.89,26.67 IC14.3
  Bottom 0.406: IC19.9 67.31,77.47 v125.73,77.47
EM0
  Bottom 0.406: IC20.2 109.22,88.9 SV11.6
EM0_S
  Top 0.406: IC7.10 114.3,55.88 114.3,73.03 110.49,76.83 110.49,79.38 111.12,80.01 113.03,80.01 113.03,92.71 IC20.1
EM1
  Top 0.406: IC20.6 106.68,81.28 106.68,76.83 104.78,74.93 102.87,74.93 102.87,85.09 SV11.8
EM1_S
  Top 0.406: IC7.11 115.57,58.42 115.57,73.03 111.76,76.83 IC20.7
EM2
  Bottom 0.406: IC20.9 118.11,80.01 105.41,80.01 SV11.12
EM2_S
  Top 0.406: IC7.12 116.84,60.96 116.84,76.2 IC20.8
EM3
  Top 0.406: IC20.13 114.3,96.52 105.41,96.52 105.41,77.47 SV11.16
EM3_S
  Top 0.406: IC7.13 120.65,64.77 120.65,92.71 IC20.14
EMA3  (via drill 0.81)
  Top 0.406: IC18.6 62.23,59.69 v62.23,68.58
  Bottom 0.406: v62.23,68.58 63.5,69.85 102.87,69.85 SV11.20
EMA3_S
  Bottom 0.406: J1.1 IC18.7
GND  (via drill 0.81)
  Top 0.406: SV10.1 SV10.3 SV10.5 SV10.7 SV10.9 | SV10.10 SV10.9 | SV10.34 SV10.33 SV10.31 SV10.29 SV10.27 SV10.25 | SV10.13 SV10.11 SV10.9 | SV10.13 SV10.14 | SV10.17 SV10.15 SV10.13 | SV10.17 SV10.18 | SV10.21 SV10.19 SV10.17 | SV10.21 SV10.22 | SV10.25 SV10.23 SV10.21 | SV10.26 SV10.25 | SV09.1 SV09.3 SV09.5 SV09.7 SV09.9 | SV09.10 SV09.9 | IC6.15 IC6.16 IC6.17 IC6.18 IC6.19 IC6.20 41.91,31.75 44.45,31.75 v44.45,49.53 | SV09.13 SV09.11 SV09.9 | SV09.13 SV09.14 | SV09.17 SV09.15 SV09.13 | SV09.17 SV09.18 | SV09.21 SV09.19 SV09.17 | SV09.21 SV09.22 | SV09.25 SV09.23 SV09.21 | SV09.25 SV09.26 | SV09.34 SV09.33 SV09.31 SV09.29 SV09.27 SV09.25 | 86.36,15.24 IC9.22 | 86.36,15.24 86.36,10.16 IC10.8 | IC12.8 90.17,31.75 90.17,43.81 89.53,44.45 86.36,44.45 86.36,15.24 | C1.2 81.28,55.88 IC22.7 | C3.2 C2.2 | IC7.1 IC7.2 IC7.3 IC7.4 SV11.26 SV11.25 | SV11.21 SV11.19 SV11.17 | SV11.21 SV11.22 | SV11.25 SV11.23 SV11.21 | SV11.34 SV11.33 SV11.31 SV11.29 SV11.27 SV11.25 | IC13.10 125.73,36.83 125.73,46.99 J4.1 J3.1 | SV11.17 SV11.15 SV11.13 SV11.11 SV11.9 SV11.7 SV11.5 SV11.3 SV11.1 | SV11.18 SV11.17 | C4.2 D3.C 83.82,91.44 D6.A | IC14.8 140.97,12.7 140.97,13.34 141.6,13.97 147.32,13.97 J2.1
  Bottom 0.406: IC15.11 24.13,85.09 8.89,85.09 SV10.10 | SV10.26 8.89,62.23 24.13,62.23 IC16.11 26.67,62.23 46.99,62.23 SV09.25 | SV09.10 IC19.4 | SV09.33 v44.45,49.53 | 102.87,6.35 IC11.8 | 102.87,6.35 90.17,6.35 IC10.8 | 102.87,6.35 112.39,6.35 113.03,6.99 118.75,6.99 IC5.8 122.56,7.62 123.83,8.89 130.81,8.89 IC14.8 | C3.2 IC18.11 64.77,62.23 52.07,62.23 SV09.26 | IC22.7 78.74,60.96 C2.2 | SV11.33 C1.2 | IC17.8 127,50.8 J3.1 | IC17.8 J2.1 | SV11.13 SV11.14 | SV11.18 127,73.66 IC17.1 132.08,71.12 132.08,55.88 IC17.8 | IC20.11 118.11,85.09 105.41,85.09 SV11.10 SV11.9 | SV11.7 92.08,86.36 IC21.2 82.55,92.71 D6.A
LI0  (via drill 0.81)
  Top 0.406: IC13.3 v106.68,21.59
  Bottom 0.406: IC10.14 102.23,20.32 103.5,21.59 v106.68,21.59
LI1  (via drill 0.81)
  Top 0.406: IC10.15 99.06,25.4 v99.06,27.94 | v107.95,31.75 109.22,33.02 IC13.4
  Bottom 0.406: v99.06,27.94 102.87,31.75 v107.95,31.75
LI2  (via drill 0.81)
  Top 0.406: IC10.4 91.44,20.32 v91.44,27.94
  Bottom 0.406: v91.44,27.94 92.71,29.21 97.16,29.21 102.23,34.29 115.57,34.29 IC13.7
LI3
  Top 0.406: IC11.14 116.84,20.32 116.84,33.02 IC13.8
LI4  (via drill 0.81)
  Top 0.406: v114.3,22.86 115.57,24.13 115.57,39.37 IC13.13
  Bottom 0.406: v114.3,22.86 IC11.15
LI5
  Top 0.406: IC11.4 105.41,19.05 105.41,36.2 111.12,41.91 113.03,41.91 113.03,43.81 113.67,44.45 116.84,44.45 IC13.14
LI6
  Bottom 0.406: IC12.14 97.79,44.45 107.95,44.45 IC13.17
LI7
  Bottom 0.406: IC12.15 108.58,45.72 110.49,43.81 110.49,41.91 107.95,41.91 IC13.18
N$1  (via drill 0.81)
  Top 0.406: IC2.9 44.45,77.47 v44.45,55.24
  Bottom 0.406: IC1.2 3.81,19.05 3.81,34.29 | 3.81,34.29 5.71,34.29 10.16,29.84 10.16,29.21 11.43,27.94 IC3.10 | v44.45,55.24 34.92,45.72 5.71,45.72 3.81,43.81 3.81,34.29
N$2
  Top 0.406: D2.C 76.2,91.44 D1.A
N$3
  Top 0.406: D4.C 85.09,85.09 85.09,92.71 D3.A
N$5
  Top 0.406: D6.C 78.74,86.36 D5.A
N$6
  Top 0.406: C1.1 R4.1 78.74,60.96 80.01,60.96 | 80.01,60.96 IC22.6 | IC22.2 80.01,69.85 80.01,60.96
N$7
  Top 0.406: C2.1 78.74,68.58 78.74,70.48 80.64,72.39 82.55,72.39 82.55,69.85 IC22.3
N$8
  Top 0.406: IC22.12 IC22.13 87.63,72.39 87.63,74.93 R3.1 C4.1
N$10
  Bottom 0.406: C3.1 72.39,67.31 87.63,67.31 IC22.11
PHASE
  Bottom 0.406: IC1.12 11.43,16.51 4.45,16.51 2.54,18.41 2.54,72.39 41.91,72.39 44.45,69.85 62.23,69.85 64.77,72.39 125.73,72.39 IC17.2
PSM_P
  Top 0.406: IC3.11 6.35,36.83 3.81,36.83 3.81,41.91 IC3.1
  Bottom 0.406: IC22.8 83.19,58.42 79.38,54.61 53.98,54.61 43.81,44.45 6.35,44.45 IC3.1
PSM_S  (via drill 0.81)
  Top 0.406: IC2.5 IC2.4 IC2.3 | IC22.9 91.44,63.5 v91.44,79.38
  Bottom 0.406: v91.44,79.38 89.53,81.28 67.94,81.28 66.67,82.55 34.29,82.55 IC2.5
TTA
  Bottom 0.406: IC19.1 55.88,88.9 SV09.6
TTA_S
  Top 0.406: IC17.3 125.73,62.23 125.73,53.98 123.19,51.44 123.19,44.45 IC13.11 | IC1.11 19.05,6.35 57.15,6.35 57.15,20.95 57.78,21.59 63.5,21.59 63.5,46.35 67.31,50.16 67.31,61.59 66.67,62.23 64.77,62.23 64.77,89.53 65.41,90.17 67.31,90.17 67.31,92.08 66.67,92.71 | 66.67,92.71 59.69,92.71 59.69,90.17 IC19.2 | IC13.1 99.06,38.1 99.06,90.81 94.61,95.25 66.67,95.25 66.67,92.71
  Bottom 0.406: IC13.1 104.14,38.1 132.72,38.1 133.35,38.73 133.35,43.18 IC13.11
TTB
  Top 0.406: IC19.7 52.07,82.55 52.07,85.09 SV09.8
TTB_S  (via drill 0.81)
  Top 0.406: v20.32,76.2 IC6.1
  Bottom 0.406: v20.32,76.2 46.35,76.2 47.62,77.47 57.15,77.47 IC19.6
VCC  (via drill 0.81)
  Top 0.406: R4.2 87.63,57.15 87.63,62.23 IC22.10 90.17,64.77 90.17,74.93 | R3.2 IC22.1 | IC21.1 90.17,87.63 90.17,74.93 | IC22.14 90.17,74.93 | IC14.16 138.43,34.29 138.43,69.85 IC17.16 | IC15.4 16.51,87.63 16.51,94.61 17.14,95.25 22.86,95.25 v22.86,59.69 | IC8.30 57.15,41.91 57.15,44.45 | IC8.32 57.15,44.45 | IC13.20 102.87,41.91 102.87,34.92 102.23,34.29 97.79,34.29 | 97.79,34.29 97.79,46.99 IC12.16 | IC10.16 95.25,24.13 95.25,20.95 94.61,20.32 92.71,20.32 92.71,31.11 95.89,34.29 97.79,34.29 | IC18.4 57.15,59.69 57.15,44.45
  Bottom 0.406: IC22.1 IC22.14 90.17,74.93 115.57,74.93 | IC20.4 110.49,87.63 97.79,87.63 IC21.1 | IC17.16 133.35,74.93 115.57,74.93 | J5.1 115.57,74.93 | IC16.4 19.05,59.69 v22.86,59.69 57.15,59.69 IC18.4 | IC10.16 97.79,24.13 110.49,24.13 IC11.16 113.03,26.67 125.73,26.67 IC5.16 | 76.83,45.72 71.75,45.72 69.22,48.26 62.23,48.26 59.69,45.72 IC8.32 | 76.83,45.72 IC9.32 | IC12.16 95.25,49.53 82.55,49.53 | 82.55,49.53 80.64,49.53 76.83,45.72 | R4.2 87.63,54.61 83.19,54.61 82.55,53.98 82.55,49.53
VDD  (via drill 0.81)
  Top 0.406: IC7.5 113.03,59.69 113.03,55.88 114.3,54.61 124.46,54.61 124.46,62.23 | 124.46,62.23 J5.2 121.92,78.74 121.92,93.34 117.47,97.79 44.45,97.79 IC2.14 | IC7.16 118.11,69.85 118.11,62.87 118.75,62.23 124.46,62.23 | IC1.14 6.35,26.67 2.54,26.67 2.54,42.55 4.45,44.45 12.7,44.45 IC3.16 | 33.66,60.33 35.56,58.42 v35.56,43.18 IC6.24 | 33.66,60.33 IC4.5 | IC4.16 40.64,74.3 40.01,74.93 36.83,74.93 | 36.83,74.93 36.83,63.5 33.66,60.33 | 36.83,74.93 v36.83,90.17
  Bottom 0.406: v36.83,90.17 IC2.14 | v35.56,43.18 IC3.16
VEE  (via drill 0.81)
  Top 0.406: IC14.7 IC14.6 137.16,20.32 J2.2 | IC10.7 IC10.6 87.63,13.97 87.63,39.37 | IC11.6 IC11.7 104.14,9.53 v108.58,5.08 | IC12.7 IC12.6 IC12.5 87.63,39.37 | IC12.3 87.63,41.91 87.63,39.37
  Bottom 0.406: IC10.6 90.17,13.97 102.87,13.97 IC11.6 | IC12.9 93.98,33.02 IC12.7 | IC14.7 135.89,13.97 135.89,5.71 113.03,5.71 112.39,5.08 v108.58,5.08
VSS  (via drill 0.81)
  Top 0.406: IC2.7 30.48,76.2 v30.48,53.34 25.4,48.26 25.4,12.7 IC6.12 | J3.2 IC7.8 | IC1.7 3.81,6.35 3.81,24.13 IC3.8 | v74.3,46.99 71.12,43.81 71.12,12.7 IC9.16
  Bottom 0.406: v30.48,53.34 IC4.8 | 19.05,6.35 IC6.12 | 19.05,6.35 6.99,6.35 5.71,5.08 IC1.7 | 41.91,6.35 IC8.16 | 19.05,6.35 41.91,6.35 | IC9.16 64.77,6.35 41.91,6.35 | IC7.8 113.03,54.61 113.03,57.15 84.45,57.15 v74.3,46.99
WFF
  Bottom 0.406: IC18.9 69.85,59.69 71.75,59.69 72.39,60.33 72.39,63.5 67.94,63.5 66.67,64.77 55.24,64.77 53.98,66.04 SV09.24
WFF_S  (via drill 0.81)
  Top 0.406: IC12.2 95.25,45.72 95.25,39.37 | IC12.12 95.25,39.37 | IC10.2 90.17,24.13 90.17,30.48 95.25,35.56 95.25,39.37 | IC10.12 97.79,16.51 v97.79,21.59
  Bottom 0.406: IC10.5 IC10.12 IC11.5 IC11.12 | IC10.2 94.61,22.86 95.89,21.59 v97.79,21.59 102.23,21.59 103.5,22.86 IC11.2 | IC18.8 59.69,46.99 57.78,46.99 57.15,46.35 57.15,44.45 60.33,44.45 62.87,46.99 69.22,46.99 71.75,44.45 87.63,44.45 IC12.2
WLO
  Top 0.406: SV11.28 110.49,54.61 110.49,52.07 J4.2
WTE
  Top 0.406: IC18.2 54.61,69.85 54.61,71.75 53.98,72.39 50.8,72.39 SV09.20
WTE_S  (via drill 0.81)
  Top 0.406: v130.81,64.77 130.81,46.35 128.27,43.81 128.27,9.53 127.64,8.89 125.73,8.89 125.73,5.71 122.56,2.54 120.65,2.54 120.65,11.43 IC5.6
  Bottom 0.406: IC18.1 59.69,67.31 67.94,67.31 70.48,64.77 v130.81,64.77
X0
  Bottom 0.406: IC15.2 15.24,88.9 SV10.6
X0_S  (via drill 0.81)
  Top 0.406: v22.86,54.61 21.59,55.88 21.59,90.17 IC15.1
  Bottom 0.406: IC4.10 39.37,54.61 v22.86,54.61
X1
  Top 0.406: IC15.6 8.89,81.28 8.89,85.09 SV10.8
X1_S  (via drill 0.81)
  Top 0.406: v39.37,73.66 39.37,59.69 IC4.11
  Bottom 0.406: IC15.7 9.53,78.74 8.26,77.47 6.99,77.47 6.35,76.83 6.35,74.93 26.04,74.93 27.3,73.66 v39.37,73.66
X2
  Bottom 0.406: IC15.9 24.13,82.55 8.89,82.55 SV10.12
X2_S  (via drill 0.81)
  Top 0.406: IC4.12 43.18,63.5 v43.18,73.03 | v27.94,74.93 25.4,77.47 IC15.8
  Bottom 0.406: v43.18,73.03 41.27,74.93 v27.94,74.93
X3
  Bottom 0.406: IC15.13 26.67,90.17 26.67,77.47 9.53,77.47 8.26,76.2 SV10.16
X3_S
  Top 0.406: IC4.13 41.91,64.77 41.91,75.56 38.1,79.38 38.1,94.61 37.47,95.25 34.29,95.25 34.29,93.34 33.66,92.71 25.4,92.71 IC15.14
X4
  Bottom 0.406: IC16.2 12.7,71.12 SV10.20
X4_S
  Bottom 0.406: IC16.1 20.32,71.12 IC4.1
X5
  Top 0.406: SV10.24 IC16.6
X5_S  (via drill 0.81)
  Top 0.406: IC16.7 19.05,54.61 v19.05,67.31
  Bottom 0.406: v19.05,67.31 31.75,67.31 IC4.2
X6
  Bottom 0.406: IC16.9 24.13,57.15 11.43,57.15 SV10.28
X6_S  (via drill 0.81)
  Top 0.406: IC16.8 29.21,57.15 v29.21,66.04
  Bottom 0.406: IC4.3 v29.21,66.04
X7
  Bottom 0.406: IC16.13 24.13,64.77 6.99,64.77 6.35,64.14 6.35,58.42 SV10.30
X7_S
  Top 0.406: IC16.14 29.21,72.39 29.21,76.83 32.38,80.01 34.29,80.01 34.29,64.77 IC4.4
~NEX  (via drill 0.81)
  Top 0.406: SV09.28 53.34,63.5 v53.34,71.12
  Bottom 0.406: v53.34,71.12 55.88,73.66 J6.2
~PSM
  Top 0.406: IC19.14 60.96,91.44 60.96,66.67 59.05,64.77 54.61,64.77 54.61,62.23 SV09.30